# Altium schematic sheet cree_lamp.SchDoc
size Letter
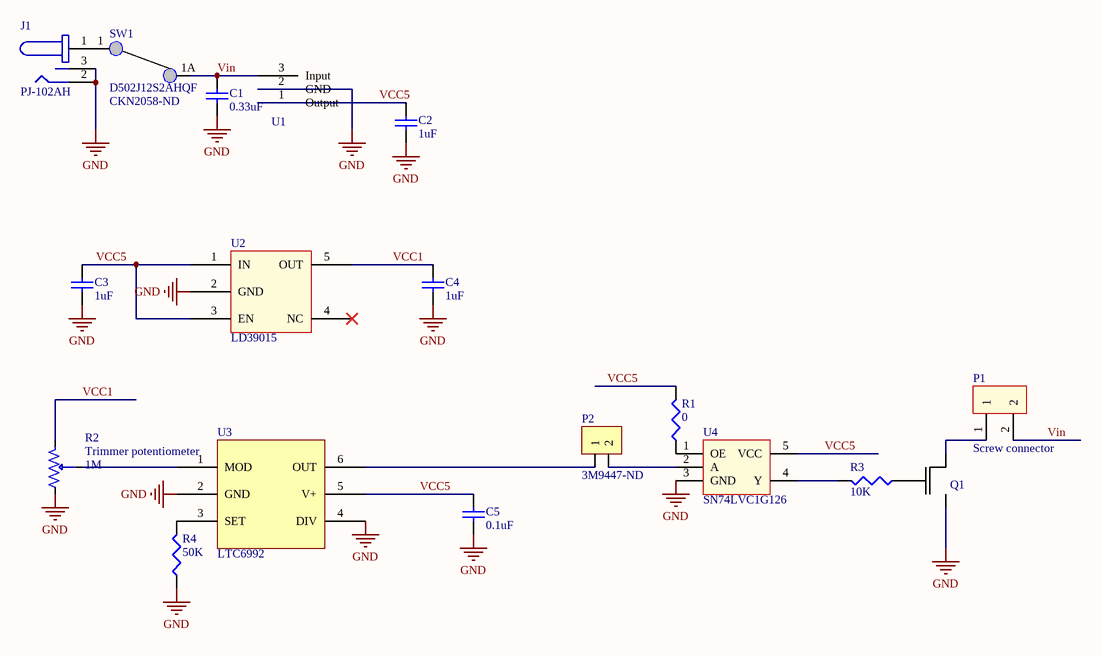
[diagram p0: cree_lamp.SchDoc]

## Parts
C1  value 0.33uF  [1608[0603]]  (hidden comment: Cap Semi)
C2  value 1uF  [1608[0603]]  (hidden comment: Cap Semi)
C3  value 1uF  [1608[0603]]  (hidden comment: Cap Semi)
C4  value 1uF  [1608[0603]]  (hidden comment: Cap Semi)
C5  value 0.1uF  [1608[0603]]  (hidden comment: Cap Semi)
J1  PJ-102AH  [PJ-102AH]
P1  Screw connector  [MPT_2position]
P2  Supplier Part Number 1: 3M9447-ND  [1x2 header]  (hidden comment: 1 x 2 header)
Q1  Si2312CDS  [SOT95P250-3N]  (value not drawn)
R1  value 0  [J1-0603]  (hidden comment: Res3)
R2  Trimmer potentiometer  value 1M  [3386P]
R3  value 10K  [J1-0603]  (hidden comment: Res3)
R4  value 50K  [J1-0603]  (hidden comment: Res3)
SW1  D502J12S2AHQF  Supplier Part Number 1: CKN2058-ND  [Rocker switch]
U1  LM78L05  [TO92]  (value not drawn)
U2  LD39015  [SOT23-5]
U3  LTC6992  [TSOT23-6]
U4  SN74LVC1G126  [SOT23-5]

## Nets
GND: C1.1 C2.1 C3.1 C4.1 C5.1 J1.2 J1.3 Q1.2(S) R2.1 R4.1 U1.2(GND) U2.2(GND) U3.2(GND) U3.4(DIV) U4.3(GND)
VCC1: C4.2 R2.3 U2.5(OUT)
VCC5: C2.2 C3.2 C5.2 R1.2 U1.1(Output) U2.1(IN) U2.3(EN) U3.5(V+) U4.5(VCC)
Vin: C1.2 P1.2 SW1.1A U1.3(Input)
NetJ1_1: J1.1 SW1.1
NetP1_1: P1.1 Q1.3(D)
NetP2_1: P2.1 U3.6(OUT)
NetP2_2: P2.2 U4.2(A)
NetQ1_1: Q1.1(G) R3.1
NetR1_1: R1.1 U4.1(OE)
NetR2_2: R2.2 U3.1(MOD)
NetR3_2: R3.2 U4.4(Y)
NetR4_2: R4.2 U3.3(SET)

Not connected (* = marked no-connect by the designer): U2 4(NC)*

## Notes on the sheet
- Title
- Date:
- Author:
- Revision:
- Sheet
- of
- University of Michigan
- File:

## Library data of the parts
C1-C5 = Cap Semi: Capacitor (Semiconductor SIM Model); Published: 8-Jun-2000; LatestRevisionDate: 29-May-2009; LatestRevisionNote: IPC-7351 Footprint Added.; PackageReference: C1206; Publisher: Altium Limited; PackageDescription: Chip Capacitor
J1 = PJ-102AH: CONN PWR JACK 2.1X5.5MM HIGH CUR; Supplier 1: Digi-Key; Supplier Part Number 1: CP-102AH-ND
P1 = MPT_2POS: Screw connector 2 positions; Supplier 1: Digi-Key; Supplier Part Number 1: 277-1273-ND
P2 = 1 x 2 header: 100 mils standard header; Supplier 1: Digi-Key
Q1 = Si2312CDS: N-Channel 20 V (D-S) MOSFET; Supplier 1: Digi-Key; Supplier Part Number 1: SI2312CDS-T1-GE3DKR-ND
R1 R3 R4 = Res3: Resistor; Published: 8-Jun-2000; LatestRevisionDate: 29-May-2009; LatestRevisionNote: IPC-7351 Footprint Added.; PackageReference: J1-0603; Publisher: Altium Limited; PackageDescription: Chip Resistor
R2 = potentiometer: Supplier 1: Digi-Key; Supplier Part Number 1: 3386P-1-105TLF-ND; Supplier 2: Digi-Key; Supplier Part Number 2: 3296Y-1-505LF-ND
SW1 = rocker switch: Miniature Snap-in Power Rocker Switches; Supplier 1: Digi-Key
U1 = LM78L05: LM78LXX Series 3-Terminal Positive Regulators; Supplier 1: Digi-Key; Supplier Part Number 1: LM78L05ACZNS/NOPB-ND
U2 = LD39015: 150 mA low quiescent current and low noise voltage regulator; Supplier 1: Digi-Key; Supplier Part Number 1: 497-6871-1-ND
U3 = LTC6992: TimerBlox: Voltage-Controlled Pulse   Width Modulator (PWM); Supplier 1: Digi-Key; Supplier Part Number 1: LTC6992CS6-1#TRMPBFTR-ND
U4 = SN74LVC1G126: Single Bus Buffer Gate With 3-State Output; Supplier 1: Digi-Key; Supplier Part Number 1: 296-11605-1-ND